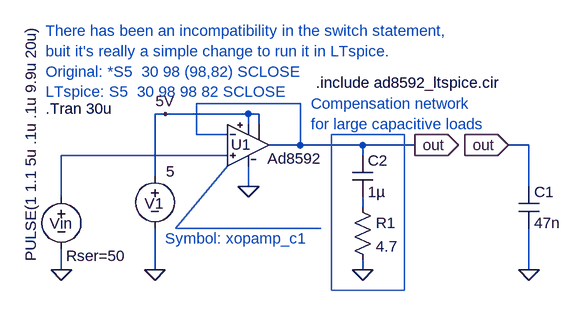
[diagram p0: schematic ad8592_test.asc]
ad8592_test.asc, the LTspice schematic file:
Version 4
SHEET 1 920 680
WIRE 208 176 48 176
WIRE 0 192 -16 192
WIRE 128 192 0 192
WIRE 144 192 128 192
WIRE 128 208 128 192
WIRE 144 208 144 192
WIRE 48 224 48 176
WIRE 96 224 48 224
WIRE 208 240 208 176
WIRE 208 240 160 240
WIRE 304 240 208 240
WIRE 384 240 304 240
WIRE 560 240 528 240
WIRE 96 256 -160 256
WIRE 304 256 304 240
WIRE -16 288 -16 192
WIRE 128 304 128 272
WIRE 560 304 560 240
WIRE -160 320 -160 256
WIRE 304 336 304 320
WIRE -160 432 -160 400
WIRE -16 432 -16 368
WIRE 304 432 304 416
WIRE 560 432 560 368
FLAG 128 304 0
FLAG -160 432 0
FLAG -16 432 0
FLAG 560 432 0
FLAG 384 240 out
IOPIN 384 240 Out
FLAG 304 432 0
FLAG 528 240 out
IOPIN 528 240 In
FLAG 0 192 5V
SYMBOL voltage -16 272 R0
WINDOW 0 -16 58 Left 0
WINDOW 3 17 9 Left 0
SYMATTR InstName V1
SYMATTR Value 5
SYMBOL voltage -160 304 R0
WINDOW 3 -47 -249 VRight 0
WINDOW 123 0 0 Left 0
WINDOW 39 7 107 Left 0
WINDOW 0 -18 57 Left 0
SYMATTR Value PULSE(1 1.1 5u .1u .1u 9.9u 20u)
SYMATTR SpiceLine Rser=50
SYMATTR InstName Vin
SYMBOL xopamp_c1 128 176 R0
WINDOW 0 -27 63 Left 0
WINDOW 3 29 85 Left 0
SYMATTR InstName U1
SYMATTR Value Ad8592
SYMBOL cap 544 304 R0
SYMATTR InstName C1
SYMATTR Value 47n
SYMBOL cap 288 256 R0
SYMATTR InstName C2
SYMATTR Value 1µ
SYMBOL res 288 320 R0
SYMATTR InstName R1
SYMATTR Value 4.7
TEXT -184 184 Left 0 !.Tran 30u
TEXT 232 144 Left 0 !.include ad8592_ltspice.cir
TEXT 0 384 Left 0 ;Symbol: xopamp_c1
TEXT 224 176 Left 0 ;Compensation network\nfor large capacitive loads
TEXT -184 64 Left 0 ;There has been an incompatibility in the switch statement,\nbuit it's really a simple change to run it in LTspice.\nOriginal: *S5  30 98 (98,82) SCLOSE\nLTspice: S5  30 98 98 82 SCLOSE
LINE Normal 16 368 240 368
LINE Normal 96 272 16 368
RECTANGLE Normal 368 464 256 224

The netlist it stands for:
* ad8592_test.asc
V1 5V 0 5
Vin N001 0 PULSE(1 1.1 5u .1u .1u 9.9u 20u) Rser=50
XU1 N001 out 5V 0 out 5V Ad8592  ; pins In+ In- V+ V- OUT COMP
C1 out 0 47n
C2 out N002 1µ
R1 N002 0 4.7
.Tran 30u
.include ad8592_ltspice.cir
* Symbol: xopamp_c1
* Compensation network
* for large capacitive loads
* There has been an incompatibility in the switch statement,
* buit it's really a simple change to run it in LTspice.
* Original: *S5  30 98 (98,82) SCLOSE
* LTspice: S5  30 98 98 82 SCLOSE
.backanno
.end